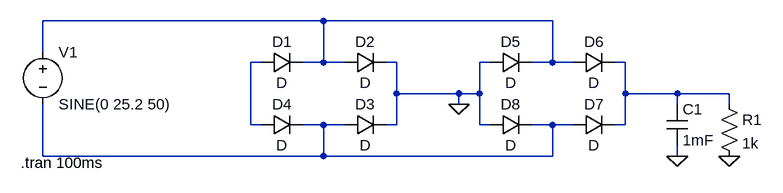
[diagram p0: schematic dual-bridge.asc]
dual-bridge.asc, the LTspice schematic file:
Version 4
SHEET 1 1192 680
WIRE 512 96 80 96
WIRE 864 96 512 96
WIRE 80 144 80 96
WIRE 416 160 400 160
WIRE 512 160 512 96
WIRE 512 160 480 160
WIRE 544 160 512 160
WIRE 624 160 608 160
WIRE 768 160 752 160
WIRE 864 160 864 96
WIRE 864 160 832 160
WIRE 896 160 864 160
WIRE 976 160 960 160
WIRE 624 208 624 160
WIRE 720 208 624 208
WIRE 752 208 752 160
WIRE 752 208 720 208
WIRE 976 208 976 160
WIRE 1056 208 976 208
WIRE 1136 208 1056 208
WIRE 720 224 720 208
WIRE 1056 224 1056 208
WIRE 1136 224 1136 208
WIRE 400 256 400 160
WIRE 416 256 400 256
WIRE 512 256 480 256
WIRE 544 256 512 256
WIRE 624 256 624 208
WIRE 624 256 608 256
WIRE 752 256 752 208
WIRE 768 256 752 256
WIRE 864 256 832 256
WIRE 896 256 864 256
WIRE 976 256 976 208
WIRE 976 256 960 256
WIRE 80 304 80 224
WIRE 512 304 512 256
WIRE 512 304 80 304
WIRE 864 304 864 256
WIRE 864 304 512 304
WIRE 1056 304 1056 288
FLAG 720 224 0
FLAG 1056 304 0
FLAG 1136 304 0
SYMBOL voltage 80 128 R0
WINDOW 123 0 0 Left 2
WINDOW 39 0 0 Left 2
SYMATTR InstName V1
SYMATTR Value SINE(0 25.2 50)
SYMBOL diode 416 176 R270
WINDOW 0 32 32 VTop 2
WINDOW 3 0 32 VBottom 2
SYMATTR InstName D1
SYMBOL diode 544 176 R270
WINDOW 0 32 32 VTop 2
WINDOW 3 0 32 VBottom 2
SYMATTR InstName D2
SYMBOL diode 544 272 R270
WINDOW 0 32 32 VTop 2
WINDOW 3 0 32 VBottom 2
SYMATTR InstName D3
SYMBOL diode 416 272 R270
WINDOW 0 32 32 VTop 2
WINDOW 3 0 32 VBottom 2
SYMATTR InstName D4
SYMBOL diode 768 176 R270
WINDOW 0 32 32 VTop 2
WINDOW 3 0 32 VBottom 2
SYMATTR InstName D5
SYMBOL diode 896 176 R270
WINDOW 0 32 32 VTop 2
WINDOW 3 0 32 VBottom 2
SYMATTR InstName D6
SYMBOL diode 896 272 R270
WINDOW 0 32 32 VTop 2
WINDOW 3 0 32 VBottom 2
SYMATTR InstName D7
SYMBOL diode 768 272 R270
WINDOW 0 32 32 VTop 2
WINDOW 3 0 32 VBottom 2
SYMATTR InstName D8
SYMBOL cap 1040 224 R0
SYMATTR InstName C1
SYMATTR Value 1mF
SYMBOL res 1120 208 R0
SYMATTR InstName R1
SYMATTR Value 1k
TEXT 46 314 Left 2 !.tran 100ms

The netlist it stands for:
* dual-bridge.asc
V1 N001 N004 SINE(0 25.2 50)
D1 N002 N001 D
D2 N001 0 D
D3 N004 0 D
D4 N002 N004 D
D5 0 N001 D
D6 N001 N003 D
D7 N004 N003 D
D8 0 N004 D
C1 N003 0 1mF
R1 N003 0 1k
.model D D
.lib standard.dio
.tran 100ms
.backanno
.end